# Altium schematic sheet arduino due component connection.SchDoc
size A4
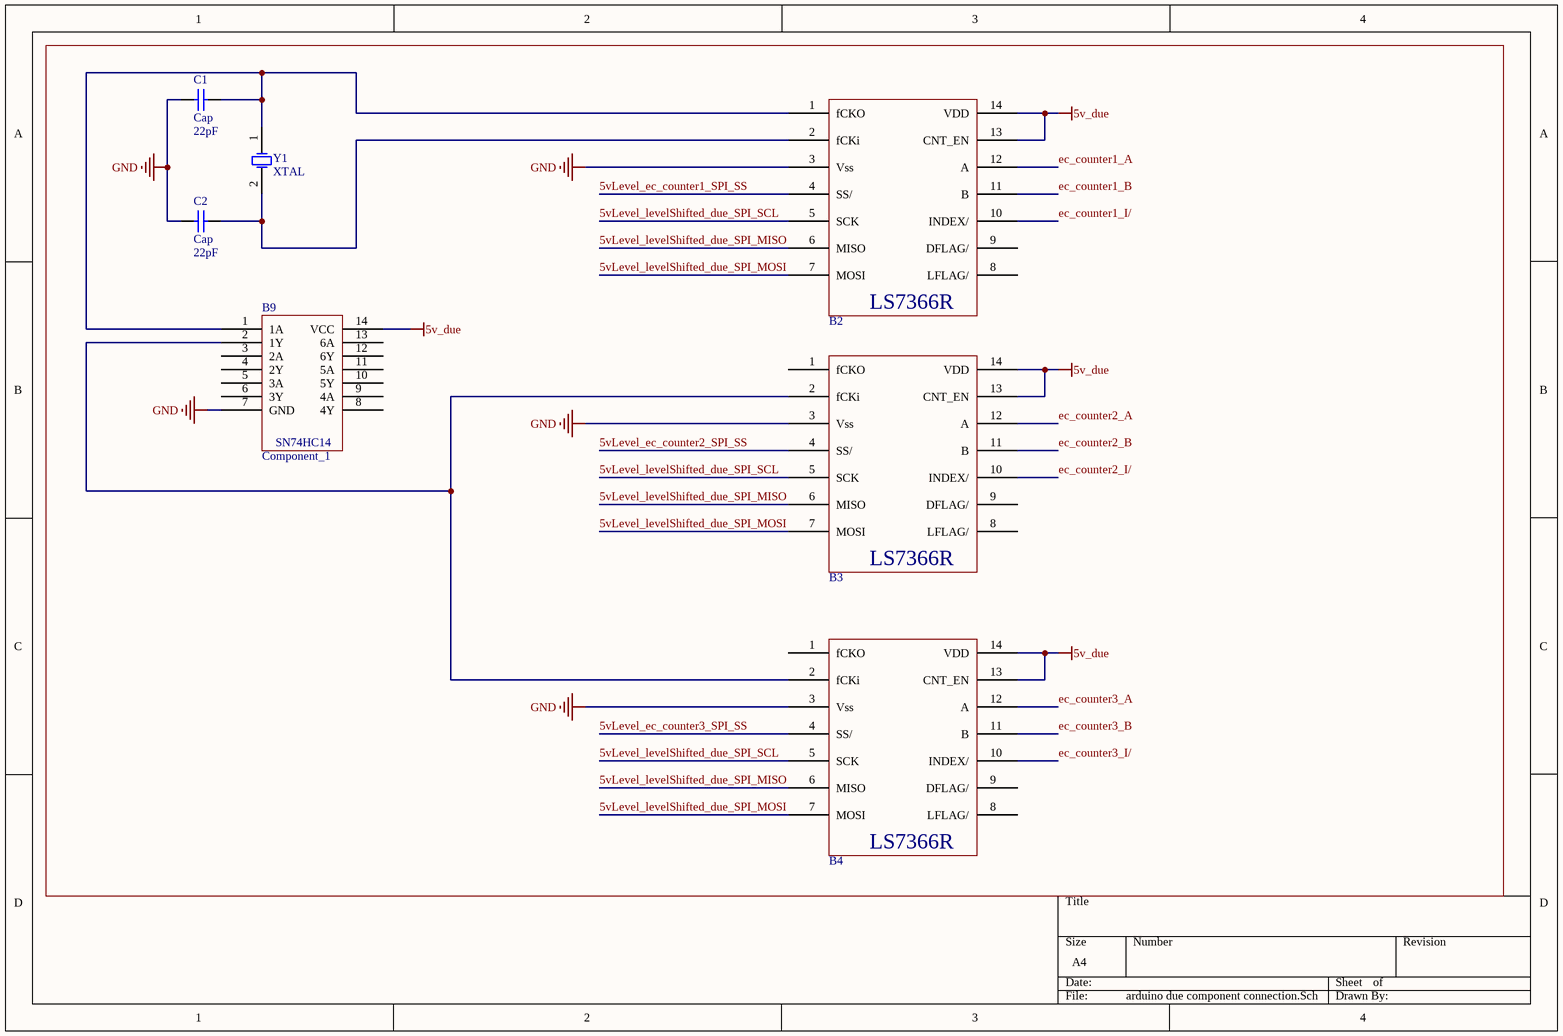
[diagram p0: arduino due component connection.SchDoc]

## Parts
B2  Component_1  [DIP-14]  (value not drawn)
B3  Component_1  [DIP-14]  (value not drawn)
B4  Component_1  [DIP-14]  (value not drawn)
B9  Component_1  [DIP-14]
C1  Cap  value 22pF  [RAD-0.1]
C2  Cap  value 22pF  [RAD-0.1]
Y1  XTAL  [R38]

## Nets
5v_due: B2.13(CNT_EN) B2.14(VDD) B3.13(CNT_EN) B3.14(VDD) B4.13(CNT_EN) B4.14(VDD) B9.14(VCC)
GND: B2.3(Vss) B3.3(Vss) B4.3(Vss) B9.7(GND) C1.1 C2.1
5vLevel_ec_counter1_SPI_SS: B2.4(SS/)
5vLevel_ec_counter2_SPI_SS: B3.4(SS/)
5vLevel_ec_counter3_SPI_SS: B4.4(SS/)
5vLevel_levelShifted_due_SPI_MISO: B2.6(MISO) B3.6(MISO) B4.6(MISO)
5vLevel_levelShifted_due_SPI_MOSI: B2.7(MOSI) B3.7(MOSI) B4.7(MOSI)
5vLevel_levelShifted_due_SPI_SCL: B2.5(SCK) B3.5(SCK) B4.5(SCK)
ec_counter1_A: B2.12(A)
ec_counter1_B: B2.11(B)
ec_counter1_I/: B2.10(INDEX/)
ec_counter2_A: B3.12(A)
ec_counter2_B: B3.11(B)
ec_counter2_I/: B3.10(INDEX/)
ec_counter3_A: B4.12(A)
ec_counter3_B: B4.11(B)
ec_counter3_I/: B4.10(INDEX/)
NetB2_1: B2.1(fCKO) B9.1(1A) C1.2 Y1.1(OSC1)
NetB2_2: B2.2(fCKi) C2.2 Y1.2(OSC2)
NetB3_2: B3.2(fCKi) B4.2(fCKi) B9.2(1Y)

Not connected (* = marked no-connect by the designer): B2 8(LFLAG/) 9(DFLAG/); B3 1(fCKO) 8(LFLAG/) 9(DFLAG/); B4 1(fCKO) 8(LFLAG/) 9(DFLAG/); B9 3(2A) 4(2Y) 5(3A) 6(3Y) 8(4Y) 9(4A) 10(5Y) 11(5A) 12(6Y) 13(6A)

## Notes on the sheet
- Encoder Counters
- (in symbol Component_1) LS7366R; SN74HC14

## Library data of the parts
C1 C2 = Cap: Capacitor; Published: 8-Jun-2000; LatestRevisionDate: 17-Jul-2002; LatestRevisionNote: Re-released for DXP Platform.; PackageReference: RAD-0.3; Publisher: Altium Limited; PackageDescription: Radial Cap, Thru-Hole; 2 Leads; 0.3 in Pin Spacing
Y1 = XTAL: Crystal Oscillator; Published: 8-Jun-2000; LatestRevisionDate: 17-Jul-2002; LatestRevisionNote: Re-released for DXP Platform.; PackageReference: R38; Publisher: Altium Limited; PackageDescription: Crystal, Thru-Hole; 2 Leads; Body 3.1 x 8.2 mm (Dia.xH)